# EAGLE design power-manager (EAGLE 6.4)
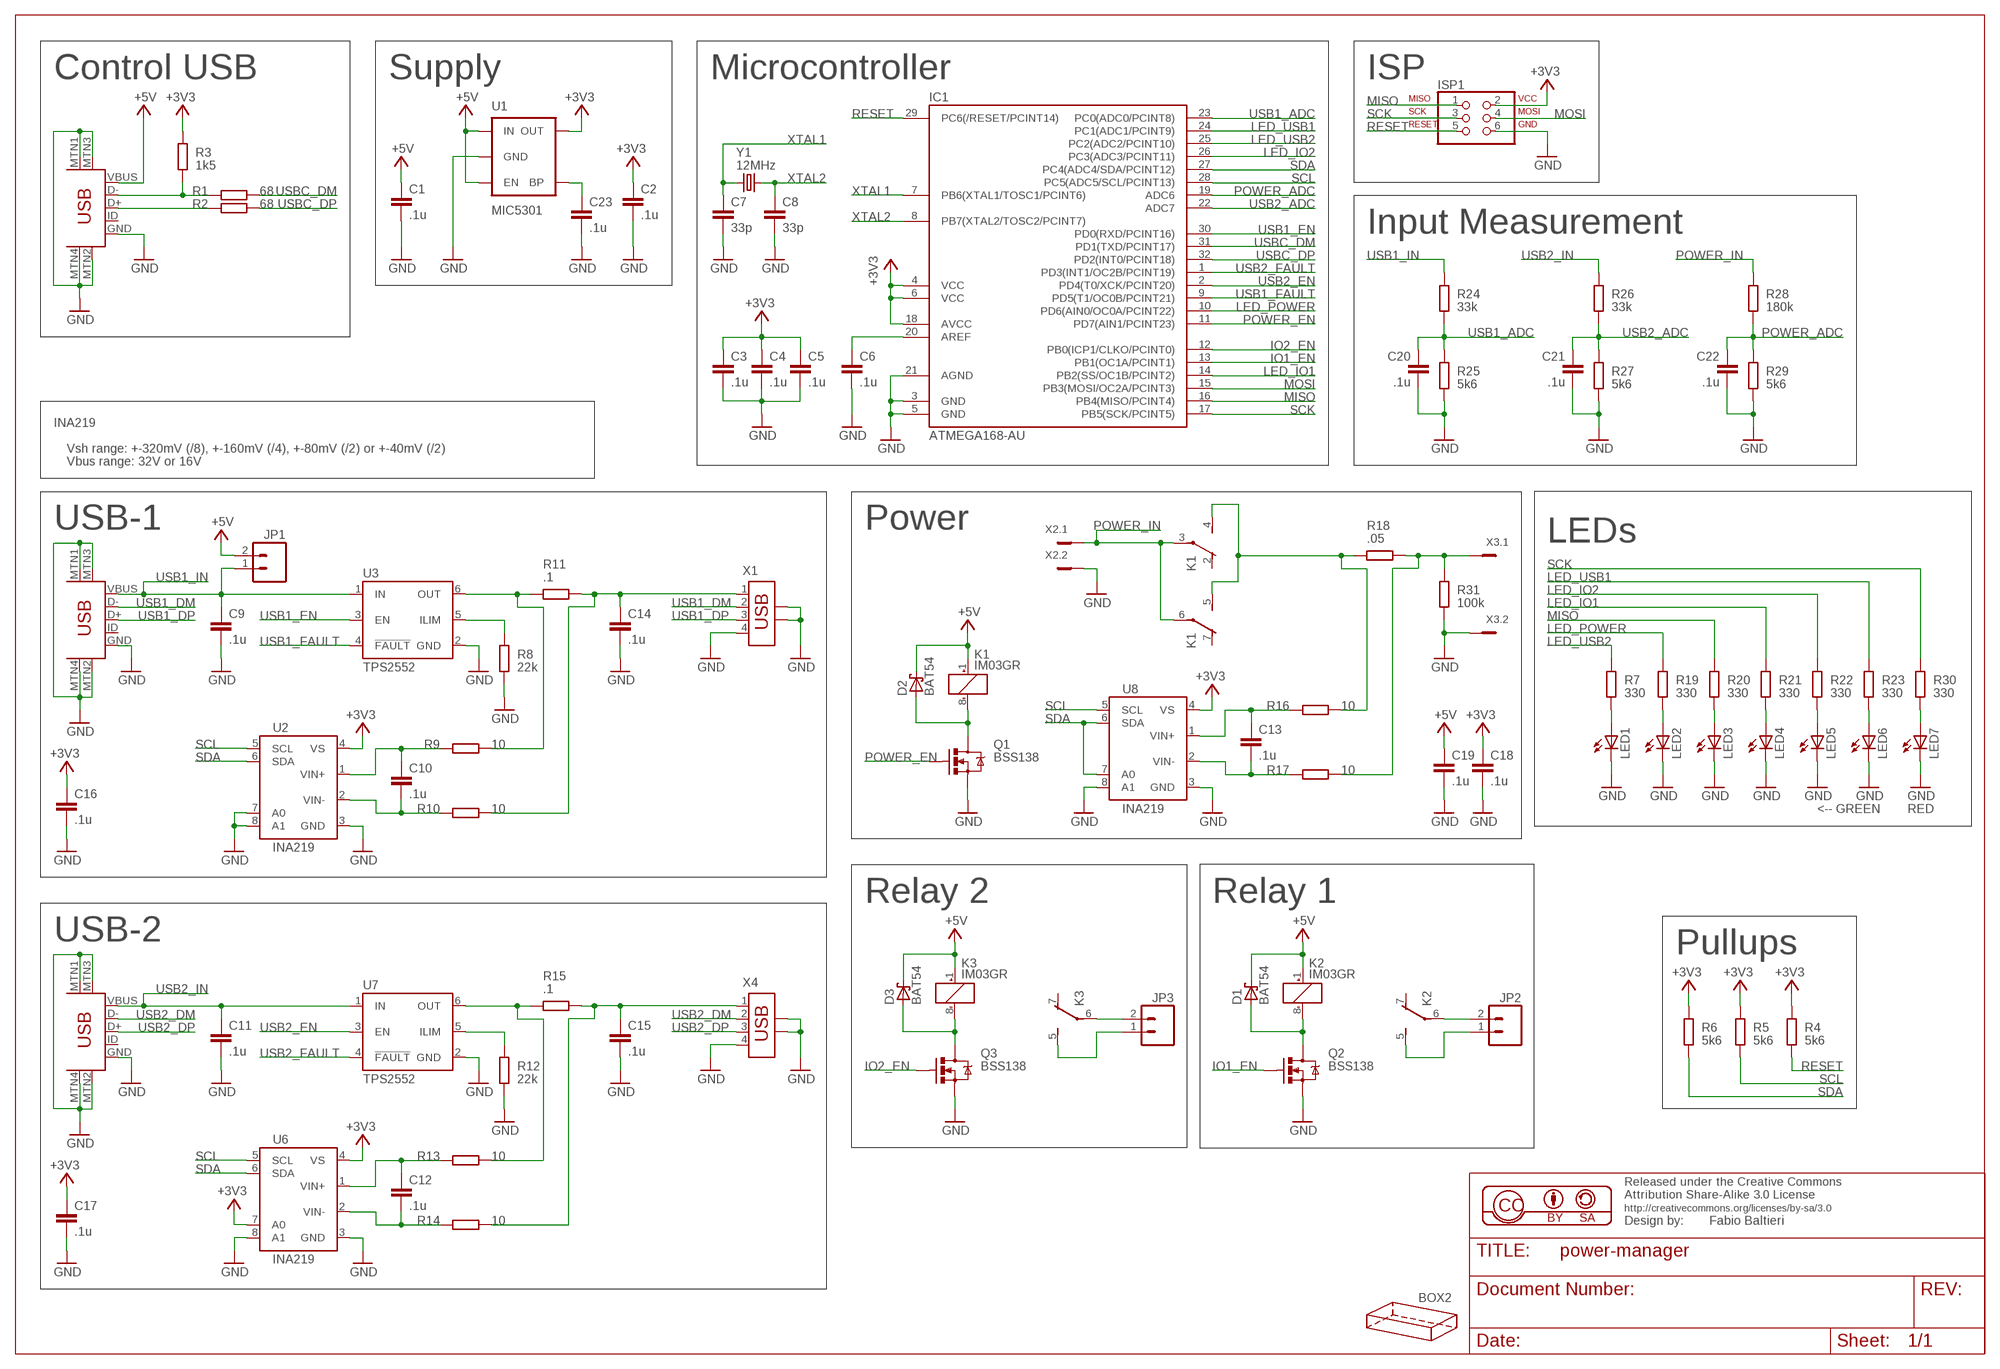
[diagram p0: schematic, sheet 1]

## Parts
BOX2  HAMMOND-BOX-K  [1551K]
C1  .1u  C-EUC0805  [C0805]
C2  .1u  C-EUC0805  [C0805]
C3  .1u  C-EUC0805  [C0805]
C4  .1u  C-EUC0805  [C0805]
C5  .1u  C-EUC0805  [C0805]
C6  .1u  C-EUC0805  [C0805]
C7  33p  C-EUC0805  [C0805]
C8  33p  C-EUC0805  [C0805]
C9  .1u  C-EUC0805  [C0805]
C10  .1u  C-EUC0805  [C0805]
C11  .1u  C-EUC0805  [C0805]
C12  .1u  C-EUC0805  [C0805]
C13  .1u  C-EUC0805  [C0805]
C14  .1u  C-EUC0805  [C0805]
C15  .1u  C-EUC0805  [C0805]
C16  .1u  C-EUC0805  [C0805]
C17  .1u  C-EUC0805  [C0805]
C18  .1u  C-EUC0805  [C0805]
C19  .1u  C-EUC0805  [C0805]
C20  .1u  C-EUC0805  [C0805]
C21  .1u  C-EUC0805  [C0805]
C22  .1u  C-EUC0805  [C0805]
C23  .1u  C-EUC0805  [C0805]
D1  BAT54  [SOT23]
D2  BAT54  [SOT23]
D3  BAT54  [SOT23]
IC1  ATMEGA168-AU  [TQFP32-08]
ISP1  ISP-AVR910PTH  [2X03]
JP1  M02PTH  [1X02]
JP2  M02PTH  [1X02]
JP3  M02PTH  [1X02]
K1  IM03GR  G6J-2FL-Y  [G6J-2FL-Y]
K2  IM03GR  G6J-2FL-Y  [G6J-2FL-Y]
K3  IM03GR  G6J-2FL-Y  [G6J-2FL-Y]
LED1  LEDSML0805  [SML0805]
LED2  LEDSML0805  [SML0805]
LED3  LEDSML0805  [SML0805]
LED4  LEDSML0805  [SML0805]
LED5  LEDSML0805  [SML0805]
LED6  LEDSML0805  [SML0805]
LED7  LEDSML0805  [SML0805]
Q1  BSS138  BSS138TRANS-00830  [SOT23-3]
Q2  BSS138  BSS138TRANS-00830  [SOT23-3]
Q3  BSS138  BSS138TRANS-00830  [SOT23-3]
R1  68  R-EU_R0603  [R0603]
R2  68  R-EU_R0603  [R0603]
R3  1k5  R-EU_R0603  [R0603]
R4  5k6  R-EU_R0603  [R0603]
R5  5k6  R-EU_R0603  [R0603]
R6  5k6  R-EU_R0603  [R0603]
R7  330  R-EU_R0603  [R0603]
R8  22k  R-EU_R0603  [R0603]
R9  10  R-EU_R0603  [R0603]
R10  10  R-EU_R0603  [R0603]
R11  .1  R-EU_R0805  [R0805]
R12  22k  R-EU_R0603  [R0603]
R13  10  R-EU_R0603  [R0603]
R14  10  R-EU_R0603  [R0603]
R15  .1  R-EU_R0805  [R0805]
R16  10  R-EU_R0603  [R0603]
R17  10  R-EU_R0603  [R0603]
R18  .05  R-EU_R0805  [R0805]
R19  330  R-EU_R0603  [R0603]
R20  330  R-EU_R0603  [R0603]
R21  330  R-EU_R0603  [R0603]
R22  330  R-EU_R0603  [R0603]
R23  330  R-EU_R0603  [R0603]
R24  33k  R-EU_R0603  [R0603]
R25  5k6  R-EU_R0603  [R0603]
R26  33k  R-EU_R0603  [R0603]
R27  5k6  R-EU_R0603  [R0603]
R28  180k  R-EU_R0603  [R0603]
R29  5k6  R-EU_R0603  [R0603]
R30  330  R-EU_R0603  [R0603]
R31  100k  R-EU_R0603  [R0603]
U1  MIC5301  V_REG_LDOSMD  [SOT23-5]
U2  INA219  [SOT23-8L]
U3  TPS2552  [SOT23-6L]
U6  INA219  [SOT23-8L]
U7  TPS2552  [SOT23-6L]
U8  INA219  [SOT23-8L]
U$1  USB-MINIB-5PIN  [USB-MINIB]
U$2  USB-MINIB-5PIN  [USB-MINIB]
U$3  USB-MINIB-5PIN  [USB-MINIB]
X1  USB-787616  [USB]
X2  MC2  [MC2]
X3  MC2  [MC2]
X4  USB-787616  [USB]
Y1  12MHz  CRYSTAL5X3  [CRYSTAL-SMD-5X3]

## Nets
+3V3: C2.1 C3.1 C4.1 C5.1 C16.1 C17.1 C18.1 IC1.4(VCC) IC1.6(VCC) IC1.18(AVCC) ISP1.2 R3.1 R4.1 R5.1 R6.1 U1.5(OUT) U2.4(VS) U6.4(VS) U6.7(A0) U8.4(VS)
+5V: C1.1 C19.1 D1.3(C) D2.3(C) D3.3(C) JP1.2 K1.1(1:+) K2.1(1:+) K3.1(1:+) U1.1(IN) U1.3(EN) U$1.VBUS
GND: C1.2 C2.2 C3.2 C4.2 C5.2 C6.2 C7.2 C8.2 C9.2 C11.2 C14.2 C15.2 C16.2 C17.2 C18.2 C19.2 C20.2 C21.2 C22.2 C23.2 IC1.3(GND) IC1.5(GND) IC1.21(AGND) ISP1.6 LED1.C LED2.C LED3.C LED4.C LED5.C LED6.C LED7.C Q1.2(S) Q2.2(S) Q3.2(S) R8.2 R12.2 R25.2 R27.2 R29.2 R31.2 U1.2(GND) U2.3(GND) U2.7(A0) U2.8(A1) U3.2(GND) U6.3(GND) U6.8(A1) U7.2(GND) U8.3(GND) U8.8(A1) U$1.GND U$1.MTN1(MTN2) U$1.MTN2(MTN3) U$1.MTN3(MTN1) U$1.MTN4 U$2.GND U$2.MTN1(MTN2) U$2.MTN2(MTN3) U$2.MTN3(MTN1) U$2.MTN4 U$3.GND U$3.MTN1(MTN2) U$3.MTN2(MTN3) U$3.MTN3(MTN1) U$3.MTN4 X1.4 X1.SHLD1 X1.SHLD2 X2.2 X3.2 X4.4 X4.SHLD1 X4.SHLD2
IO1_EN: IC1.13(PB1(OC1A/PCINT1)) Q2.1(G)
IO2_EN: IC1.12(PB0(ICP1/CLKO/PCINT0)) Q3.1(G)
LED_IO1: IC1.14(PB2(SS/OC1B/PCINT2)) R21.1
LED_IO2: IC1.26(PC3(ADC3/PCINT11)) R22.1
LED_POWER: IC1.10(PD6(AIN0/OC0A/PCINT22)) R19.1
LED_USB1: IC1.24(PC1(ADC1/PCINT9)) R23.1
LED_USB2: IC1.25(PC2(ADC2/PCINT10)) R7.1
MISO: IC1.16(PB4(MISO/PCINT4)) ISP1.1 R20.1
MOSI: IC1.15(PB3(MOSI/OC2A/PCINT3)) ISP1.4
N$1: R1.1 R3.2 U$1.D-
N$2: C6.1 IC1.20(AREF)
N$3: R2.1 U$1.D+
N$4: R8.1 U3.5(ILIM)
N$5: C23.1 U1.4(BP)
N$6: C10.2 R10.1 U2.2(VIN-)
N$7: C10.1 R9.1 U2.1(VIN+)
N$8: R9.2 R11.1 U3.6(OUT)
N$9: C14.1 R10.2 R11.2 X1.1
N$10: LED7.A R30.2
N$11: R12.1 U7.5(ILIM)
N$12: C12.2 R14.1 U6.2(VIN-)
N$13: C12.1 R13.1 U6.1(VIN+)
N$14: R13.2 R15.1 U7.6(OUT)
N$15: C15.1 R14.2 R15.2 X4.1
N$16: C13.2 R17.1 U8.2(VIN-)
N$17: C13.1 R16.1 U8.1(VIN+)
N$18: K1.4(2:S) K1.5(3:S) R16.2 R18.1
N$19: R17.2 R18.2 R31.1 X3.1
N$20: D2.1(A) K1.8(1:-) Q1.3(D)
N$22: D1.1(A) K2.8(1:-) Q2.3(D)
N$23: JP2.2 K2.6(3:P)
N$24: JP2.1 K2.5(3:S)
N$25: D3.1(A) K3.8(1:-) Q3.3(D)
N$26: JP3.2 K3.6(3:P)
N$27: JP3.1 K3.5(3:S)
N$28: LED1.A R7.2
N$29: LED2.A R19.2
N$30: LED3.A R20.2
N$31: LED4.A R21.2
N$32: LED5.A R22.2
N$33: LED6.A R23.2
POWER_ADC: C22.1 IC1.19(ADC6) R28.2 R29.1
POWER_EN: IC1.11(PD7(AIN1/PCINT23)) Q1.1(G)
POWER_IN: K1.3(2:P) K1.6(3:P) R28.1 X2.1
RESET: IC1.29(PC6(/RESET/PCINT14)) ISP1.5 R4.2
SCK: IC1.17(PB5(SCK/PCINT5)) ISP1.3 R30.1
SCL: IC1.28(PC5(ADC5/SCL/PCINT13)) R5.2 U2.5(SCL) U6.5(SCL) U8.5(SCL)
SDA: IC1.27(PC4(ADC4/SDA/PCINT12)) R6.2 U2.6(SDA) U6.6(SDA) U8.6(SDA) U8.7(A0)
USB1_ADC: C20.1 IC1.23(PC0(ADC0/PCINT8)) R24.2 R25.1
USB1_DM: U$2.D- X1.2
USB1_DP: U$2.D+ X1.3
USB1_EN: IC1.30(PD0(RXD/PCINT16)) U3.3(EN)
USB1_FAULT: IC1.9(PD5(T1/OC0B/PCINT21)) U3.4(!FAULT)
USB1_IN: C9.1 JP1.1 R24.1 U3.1(IN) U$2.VBUS
USB2_ADC: C21.1 IC1.22(ADC7) R26.2 R27.1
USB2_DM: U$3.D- X4.2
USB2_DP: U$3.D+ X4.3
USB2_EN: IC1.2(PD4(T0/XCK/PCINT20)) U7.3(EN)
USB2_FAULT: IC1.1(PD3(INT1/OC2B/PCINT19)) U7.4(!FAULT)
USB2_IN: C11.1 R26.1 U7.1(IN) U$3.VBUS
USBC_DM: IC1.31(PD1(TXD/PCINT17)) R1.2
USBC_DP: IC1.32(PD2(INT0/PCINT18)) R2.2
XTAL1: C7.1 IC1.7(PB6(XTAL1/TOSC1/PCINT6)) Y1.1
XTAL2: C8.1 IC1.8(PB7(XTAL2/TOSC2/PCINT7)) Y1.3
Unconnected: K1.2(2:O) K1.7(3:O) K2.2(2:O) K2.3(2:P) K2.4(2:S) K2.7(3:O) K3.2(2:O) K3.3(2:P) K3.4(2:S) K3.7(3:O) U$1.ID U$2.ID U$3.ID

## Notes on the sheet
- Control USB | Supply | Microcontroller | ISP
- Input Measurement
- INA219
- Vsh range: +-320mV (/8), +-160mV (/4), +-80mV (/2) or +-40mV (/2)
- Vbus range: 32V or 16V
- USB-1 | Power
- LEDs
- <-- GREEN | RED
- Relay 2 | Relay 1
- USB-2
- Pullups

## Library data of the parts
BOX2 = hammond:HAMMOND-BOX: Hammond Project boxes Hammond 1551 Transluscent Blue 50x35x20mm 1551GTBU http://www.hammondmfg.com/pdf/1551G.pdf Hammond 1551 Transluscent Blue 50x50x20mm 1551RTBU http://www.hammondmfg.com/pdf/1551R.pdf Hammond 1551 Transluscent Blue 60x35x20mm 1551HTBU http://www.hammondmfg.com/pdf/1551H.pdf Hammond 1551 Transluscent Blue 80x40x20mm 1551KTBU http://www.hammondmfg.com/pdf/1551K.pdf Hammond 1591 Transluscent Blue 100x51x22m m 1591XXATBU http://www.hammondmfg.com/pdf/1591XXA.pdf
C1-C23 = rcl:C-EU: CAPACITOR, European symbol
D1-D3 = diode:BAT54: Schottky Diodes Source: Fairchild .. BAT54.pdf
IC1 = balto:ATMEGA168
ISP1 = balto:ISP-AVR910: PIN HEADER
JP1-JP3 = SparkFun-Connectors:M02: Header 2 Standard 2-pin 0.1" header. Use with straight break away headers (SKU : PRT-00116), right angle break away headers (PRT-00553), swiss pins (PRT-00743), machine pins (PRT-00117), and female headers (PRT-00115). Molex polarized connector foot print use with SKU : PRT-08233 with associated crimp pins and housings.
K1-K3 = relay:G6J*-2?-Y: Surface-Mounting Signal Relay - G6J-Y 5.7 x 10.6 x 9 mm Source: http://www.omroncomponents.eu/ .. K125-E2-02-X.pdf; MPN: G6J-2FL-Y-TR DC4.5; OC_FARNELL: 1798618; OC_NEWARK: 04M9907
LED1-LED7 = led:LED: LED OSRAM: - CHIPLED LG R971, LG N971, LY N971, LG Q971, LY Q971, LO R971, LY R971 LH N974, LH R974 LS Q976, LO Q976, LY Q976 LO Q996 - Hyper CHIPLED LW Q18S LB Q993, LB Q99A, LB R99A - SideLED LS A670, LO A670, LY A670, LG A670, LP A670 LB A673, LV A673, LT A673, LW A673 LH A674 LY A675 LS A676, LA A676, LO A676, LY A676, LW A676 LS A679, LY A679, LG A679 - Hyper Micro SIDELED® LS Y876, LA Y876, LO Y876, LY Y876 LT Y87S - SmartLED LW L88C, LW L88S LB L89C, LB L89S, LG L890 LS L89K, LO L89K, LY L89K LS L896, LA L896, LO L896, LY L896 - TOPLED LS T670, LO T670, LY T670, LG T670, LP T670 LSG T670, LSP T670, LSY T670, LOP T670, LYG T670 LG T671, LOG T671, LSG T671 LB T673, LV T673, LT T673, LW T673 LH T674 LS T676, LA T676, LO T676, LY T676, LB T676, LH T676, LSB T676, LW T676 LB T67C, LV T67C, LT T67C, LS T67K, LO T67K, LY T67K, LW E67C LS E67B, LA E67B, LO E67B, LY E67B, LB E67C, LV E67C, LT E67C LW T67C LS T679, LY T679, LG T679 LS T770, LO T770, LY T770, LG T770, LP T770 LB T773, LV T773, LT T773, LW T773 LH T774 LS E675, LA E675, LY E675, LS T675 LS T776, LA T776, LO T776, LY T776, LB T776 LHGB T686 LT T68C, LB T68C - Hyper Mini TOPLED® LB M676 - Mini TOPLED Santana® LG M470 LS M47K, LO M47K, LY M47K Source: http://www.osram.convergy.de LUXEON: - LUMILED® LXK2-PW12-R00, LXK2-PW12-S00, LXK2-PW14-U00, LXK2-PW14-V00 LXK2-PM12-R00, LXK2-PM12-S00, LXK2-PM14-U00 LXK2-PE12-Q00, LXK2-PE12-R00, LXK2-PE12-S00, LXK2-PE14-T00, LXK2-PE14-U00 LXK2-PB12-K00, LXK2-PB12-L00, LXK2-PB12-M00, LXK2-PB14-N00, LXK2-PB14-P00, LXK2-PB14-Q00 LXK2-PR12-L00, LXK2-PR12-M00, LXK2-PR14-Q00, LXK2-PR14-R00 LXK2-PD12-Q00, LXK2-PD12-R00, LXK2-PD12-S00 LXK2-PH12-R00, LXK2-PH12-S00 LXK2-PL12-P00, LXK2-PL12-Q00, LXK2-PL12-R00 Source: www.luxeon.com KINGBRIGHT: KA-3528ASYC Source: www.kingbright.com
Q1-Q3 = SparkFun-DiscreteSemi:BSS138: NMOSFET, Enh Mode 50V/6-ohm 200mA (SOT-23) TRANS-00830; PROD_ID: TRANS-00830
R1-R31 = rcl:R-EU_: RESISTOR, European symbol
U1 = SparkFun-PowerIC:V_REG_LDO: Voltage Regulator LDO Standard 150mA LDO voltage regulator in SOT-23 layout. Micrel part MIC5205. BP (by-pass) pin is used to lower output noise with 470pF cap.
U2 U6 U8 = balto:INA219: INA219 Zero-Drift, Bi-Directional CURRENT/POWER MONITOR with I2CTM Interface
U3 U7 = balto:TPS2552: Precision adjustable current limited power distribution switch
U$1-U$3 = SparkFun-Connectors:USB-MINIB: Mini-USB "B" connector with 5th pin broken out. Created new symbol breaking out 5th "ID" pin in mini/micro USB connector spec. See: http://en.wikipedia.org/wiki/Mini_usb#Cables. Uses same footprint as 4-pin symbol. Also added pins to connect to mounting / shield pads if required (probably not generally needed as signals aren't shielded once they leave the connector).
X1 X4 = balto:USB-787616: AMP connector
X2 X3 = con-phoenix-381_l:MC2: Mini-Combicon 3.81mm horizontal 2-polig MC 1,5/2-G-3,81 Artikel-Nr. 1803277
Y1 = SparkFun-FreqCtrl:CRYSTAL: Various standard crystals. Proven footprints. Spark Fun Electronics SKU : COM-00534

## Board
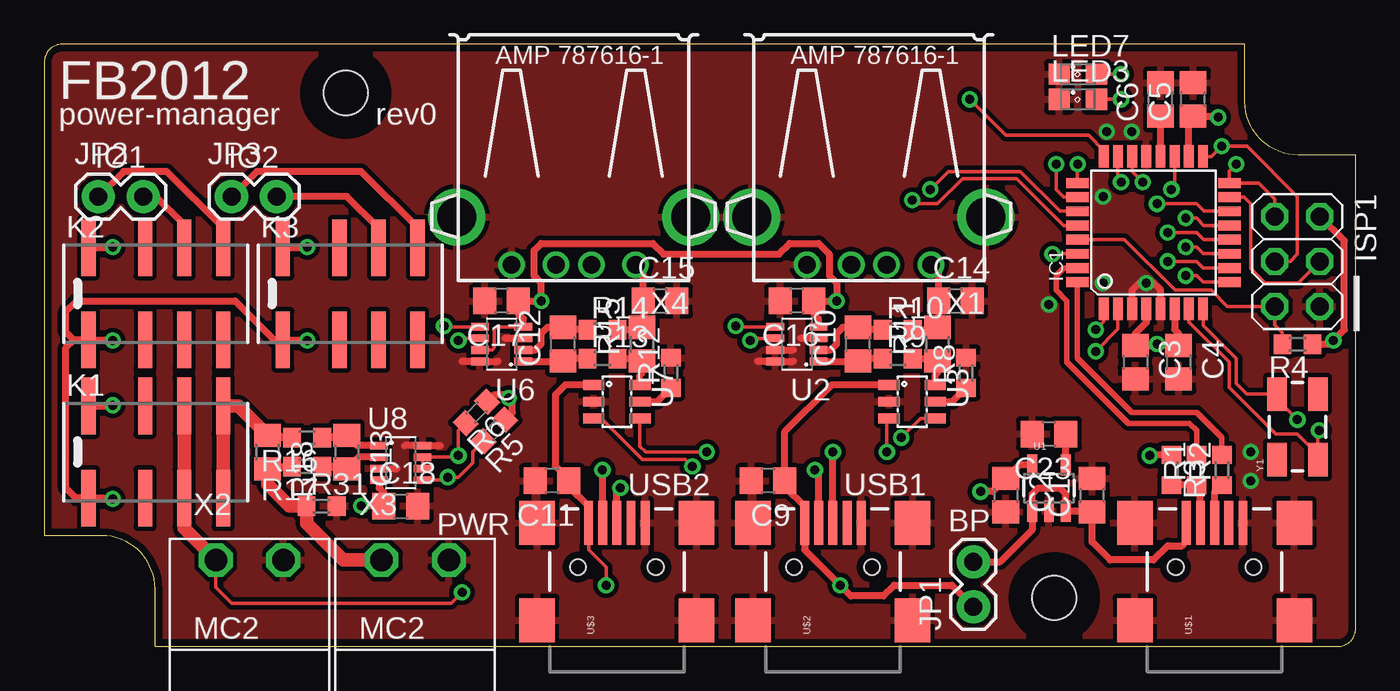
[diagram p1: board, top side]
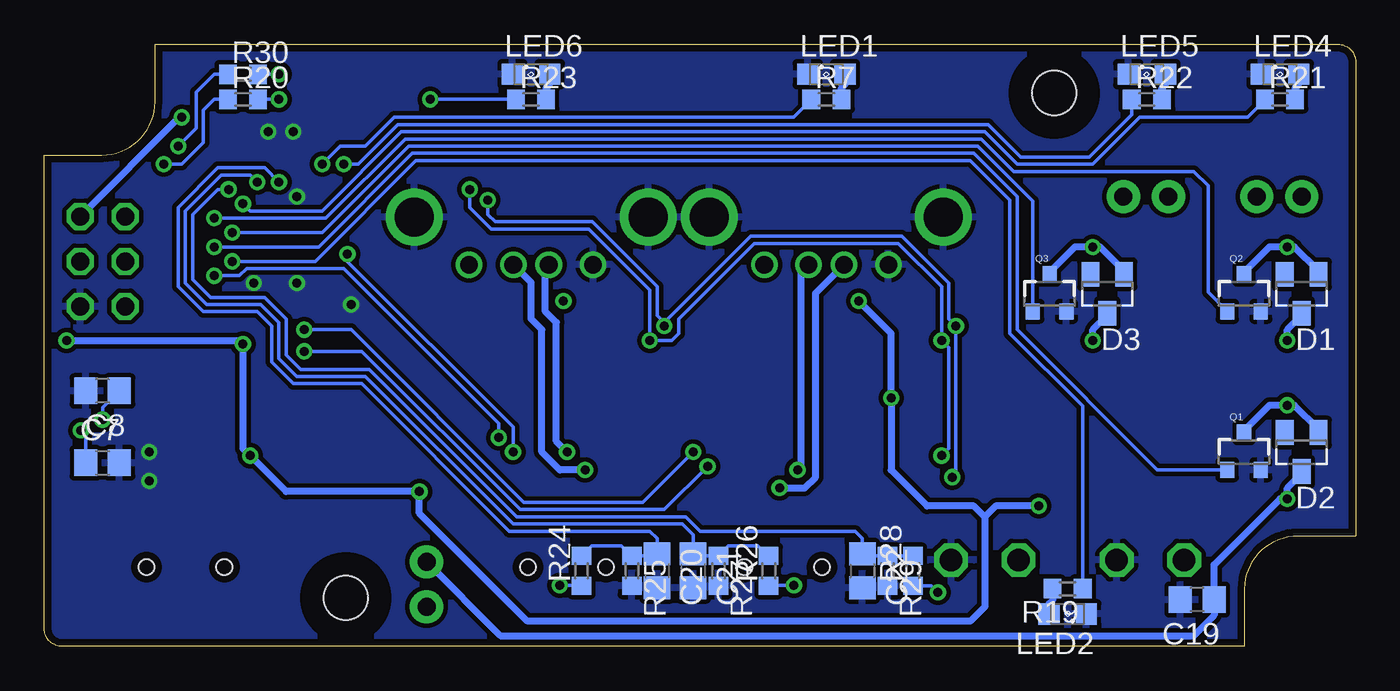
[diagram p2: board, bottom side, seen from below]

Size 74 x 34 mm. Coordinates in mm from the lower left corner, seen from the top.
Copper layers (1*16): Top 0.035mm / dielectric 1.5mm / Bottom 0.035mm
Design rules "cm *": minimum track width 8mil, minimum drill 20mil, track to track 8mil, track to pad 8mil, pad to pad 8mil, via to via 8mil, smd to smd 8mil, copper to edge 16mil, drill to drill 8mil, minimum pad ring 8mil, minimum via ring 8mil, stop-mask expansion 4mil, vias tented up to drill 20mil, thermal gap 10mil

### Footprints (pad centres in the part's own frame; a part is rotated, then mirrored left to right if it is on the bottom)
1551K = hole 2.5: 57,2.75; 17,31.25
C0805 = smd 1.3 x 1.5: 1 -0.95,0; 2 0.95,0
SOT23 = smd 1 x 1.4: 1 -0.95,-1.1; 2 0.95,-1.1; 3 0,1.1
TQFP32-08 = smd 1.27 x 0.559: 1 -4.293,2.8; 2 -4.293,2; 3 -4.293,1.2; 4 -4.293,0.4; 5 -4.293,-0.4; 6 -4.293,-1.2; 7 -4.293,-2; 8 -4.293,-2.8; 17 4.293,-2.8; 18 4.293,-2; 19 4.293,-1.2; 20 4.293,-0.4; 21 4.293,0.4; 22 4.293,1.2; 23 4.293,2; 24 4.293,2.8 | smd 0.559 x 1.27: 9 -2.8,-4.293; 10 -2,-4.293; 11 -1.2,-4.293; 12 -0.4,-4.293; 13 0.4,-4.293; 14 1.2,-4.293; 15 2,-4.293; 16 2.8,-4.293; 25 2.8,4.293; 26 2,4.293; 27 1.2,4.293; 28 0.4,4.293; 29 -0.4,4.293; 30 -1.2,4.293; 31 -2,4.293; 32 -2.8,4.293
2X03 = drill 1.016 octagon: 1 -2.54,-1.27; 2 -2.54,1.27; 3 0,-1.27; 4 0,1.27; 5 2.54,-1.27; 6 2.54,1.27
1X02 = drill 1.016 pad 1.88: 1 0,0; 2 2.54,0
G6J-2FL-Y = smd 0.8 x 3.2: 1 -3.2,-2.6; 2 0,-2.6; 3 2.2,-2.6; 4 4.4,-2.6; 5 4.4,2.6; 6 2.2,2.6; 7 0,2.6; 8 -3.2,2.6
SML0805 = smd 1.2 x 1.2: A 1.05,0; C -1.05,0
SOT23-3 = smd 0.8 x 0.9: 1 -0.95,-1; 2 0.95,-1; 3 0,1.1
R0603 = smd 1 x 1.1: 1 -0.85,0; 2 0.85,0
R0805 = smd 1.3 x 1.5: 1 -0.95,0; 2 0.95,0
SOT23-5 = smd 0.55 x 1.2: 1 -0.95,-1.3; 2 0,-1.3; 3 0.95,-1.3; 4 0.95,1.3; 5 -0.95,1.3
SOT23-8L = smd 0.44 x 1: 1 -0.975,-1.225; 2 -0.325,-1.225; 3 0.325,-1.225; 4 0.975,-1.225; 5 0.975,1.225; 6 0.325,1.225; 7 -0.325,1.225; 8 -0.975,1.225
SOT23-6L = smd 0.55 x 1.2: 1 -0.95,-1.3; 2 0,-1.3; 3 0.95,-1.3; 4 0.95,1.3; 5 0,1.3; 6 -0.95,1.3
USB-MINIB = smd 2.5 x 0.5: D+ 2.5,0; D- 2.5,0.8; GND 2.5,-1.6; ID 2.5,-0.8; VBUS 2.5,1.6 | smd 2.5 x 2: MTN1 -3,4.5; MTN2 2.5,4.5; MTN3 -3,-4.5; MTN4 2.5,-4.5 | hole 0.9: 0,2.2; 0,-2.2
USB = drill 1: 1 -3.5,12.99; 2 -1,12.99; 3 1,12.99; 4 3.5,12.99 | drill 2.2: SHLD1 -6.6,10.3; SHLD2 6.6,10.3
MC2 = drill 1.27 octagon: 1 -1.905,0; 2 1.905,0
CRYSTAL-SMD-5X3 = smd 1.9 x 1.1: 1 -1.85,-1.15; 2 1.85,-1.15; 3 1.85,1.15; 4 -1.85,1.15

### Placement (x,y rotation side)
BOX2  0,0 0 top
C1  59.13,8.53 90 top
C2  54.25,8.53 270 top
C3  61.57,16.05 270 top
C4  64.01,16.05 270 top
C5  64.82,30.89 90 top
C6  62.99,30.89 90 top
C7  70.71,10.36 0 bottom
C8  70.71,14.43 180 bottom
C9  40.84,9.35 180 top
C10  45.92,17.07 90 top
C11  28.65,9.35 180 top
C12  29.26,17.07 90 top
C13  17.07,10.97 270 top
C14  51.41,19.51 0 top
C15  34.75,19.51 0 top
C16  42.47,19.51 180 top
C17  25.81,19.51 180 top
C18  20.12,7.92 0 top
C19  8.94,2.64 180 bottom
C20  39.42,4.27 270 bottom
C21  37.39,4.27 270 bottom
C22  27.84,4.27 270 bottom
C23  56.69,11.99 180 top
D1  3.05,19.91 180 bottom
D2  3.05,10.97 180 bottom
D3  14.02,19.91 180 bottom
IC1  62.59,23.37 90 top
ISP1  70.71,21.74 270 top
JP1  52.43,2.24 90 top
JP2  3.05,25.4 0 top
JP3  10.57,25.4 0 top
K1  5.69,10.97 0 top
K2  5.69,19.91 0 top
K3  16.66,19.91 0 top
LED1  29.87,32.31 0 bottom
LED2  16.26,1.83 180 bottom
LED3  58.32,30.89 0 top
LED4  4.27,32.31 0 bottom
LED5  11.79,32.31 0 bottom
LED6  46.53,32.31 0 bottom
LED7  58.32,32.31 0 top
Q1  6.3,10.97 0 bottom
Q2  6.3,19.91 0 bottom
Q3  17.27,19.91 0 bottom
R1  65.02,9.96 90 top
R2  66.45,9.96 90 top
R3  63.6,9.96 270 top
R4  70.71,17.07 180 top
R5  25.4,12.19 225 top
R6  24.38,13.21 225 top
R7  29.87,30.89 0 bottom
R8  52.02,15.44 90 top
R9  48.16,16.26 0 top
R10  48.16,17.88 0 top
R11  50.39,17.07 90 top
R12  35.36,15.44 90 top
R13  31.5,16.26 0 top
R14  31.5,17.88 0 top
R15  33.73,17.07 90 top
R16  14.83,11.79 180 top
R17  14.83,10.16 180 top
R18  12.6,10.97 270 top
R19  16.26,3.25 180 bottom
R20  62.79,30.89 0 bottom
R21  4.27,30.89 0 bottom
R22  11.79,30.89 0 bottom
R23  46.53,30.89 0 bottom
R24  43.69,4.27 90 bottom
R25  40.84,4.27 270 bottom
R26  33.12,4.27 90 bottom
R27  35.97,4.27 270 bottom
R28  24.99,4.27 90 bottom
R29  26.42,4.27 270 bottom
R30  62.79,32.31 0 bottom
R31  15.65,7.92 0 top
U1  56.69,8.94 0 top
U2  42.47,17.07 90 top
U3  48.97,13.82 270 top
U6  25.81,17.07 90 top
U7  32.31,13.82 270 top
U8  20.12,10.36 270 top
U$1  66.04,4.47 90 top
U$2  44.5,4.47 90 top
U$3  32.31,4.47 90 top
X1  46.53,34.54 180 top
X2  11.58,4.88 0 top
X3  20.93,4.88 0 top
X4  29.87,34.54 180 top
Y1  70.71,12.4 90 top

### Tracks (layer width: path | path; a pad name or v marks a point on that pad's centre or on a via)
+3V3  (via drill 0.51)
  Top 0.203: U6.7 25.28,16.74 25.4,16.87 25.4,17.88 25.56,18.04 U6.4
  Top 0.406: IC1.18 64.59,29.7 C5.1 66.18,29.94 v66.24,29.87 | R4.1 72.54,17.07 v72.75,17.27 73.36,17.88 73.36,22.91 ISP1.2 | U2.4 43.69,18.48 43.42,18.76 C16.1 v44.7,19.51 44.7,20.52 44.3,20.93 44.3,22.15 43.69,22.76 42.06,22.76 41.45,22.15 34.95,22.15 34.34,22.76 28.04,22.76 27.64,22.35 27.64,20.93 28.04,20.52 v28.04,19.51 C17.1 26.76,18.76 27.03,18.48 U6.4 | v17.88,7.92 C18.1 19.17,8.67 18.89,8.95 U8.4 | IC1.4 62.19,18.29 61.57,17.68 C3.1 62.72,17 v62.79,17.07 62.85,17 C4.1 64.01,17.68 63.79,17.9 IC1.6 | R3.1 62.42,10.81 v62.38,10.77 | R6.1 25.4,14.22 26.01,14.22 v26.21,14.02 26.42,13.82 26.42,13.21 R5.1 | v52.83,8.74 53.51,8.74 C2.1 55.01,10.24 U1.5
  Bottom 0.406: v66.24,29.87 66.4,29.87 ISP1.2 | v72.75,17.27 62.99,17.27 v62.79,17.07 62.79,11.18 v62.38,10.77 | v17.88,7.92 20.32,7.92 20.93,7.32 | 20.93,7.32 21.54,7.92 24.18,7.92 26.21,9.96 v26.21,14.02 26.21,17.68 v28.04,19.51 | 20.93,7.32 20.93,2.23 21.74,1.42 46.74,1.42 52.83,7.52 v52.83,8.74 60.35,8.74 v62.38,10.77 | 62.18,10.57 v62.38,10.77
+5V  (via drill 0.51)
  Top 0.406: v3.86,17.27 3.82,17.31 K2.1 1.67,17.31 | v14.83,17.27 14.79,17.31 K3.1 12.96,17.31 10.77,19.51 1.83,19.51 1.22,18.9 1.22,17.76 1.67,17.31 | v3.86,8.33 3.82,8.37 K1.1 1.79,8.37 1.22,8.94 1.22,16.87 1.67,17.31 | JP1.2 53.95,4.78 55.74,6.57 U1.1 55.74,8.6 56.08,8.94 57.3,8.94 57.64,8.6 U1.3 59.08,7.64 C1.1 59.13,5.89 60.15,4.88 62.59,4.88 63.4,5.69 64.21,5.69 64.44,5.92 U$1.VBUS
  Bottom 0.406: D1.3 3.05,18.69 3.86,17.88 v3.86,17.27 | D3.3 14.02,18.69 14.83,17.88 v14.83,17.27 | D2.3 3.05,9.75 3.86,8.94 v3.86,8.33 4.27,8.33 7.99,4.61 C19.1 7.99,1.76 9.14,0.61 48.26,0.61 JP1.2
GND  (via drill 0.51)
  Top 0.406: U6.3 26.01,17.39 | 25.6,16.09 U6.8 23.57,16.09 | U2.3 42.67,17.39 | 42.27,16.09 U2.8 40.23,16.09 | U2.7 42.27,16.74 | U8.3 19.91,10.04 | 20.32,11.34 U8.8 22.35,11.34 | IC1.5 62.99,20.12 62.59,20.52 v62.18,20.52 61.79,20.52 61.39,20.12 IC1.3
  other vias: 68.07,10.97 68.07,9.35 59.74,20.52 56.69,19.3 59.74,25.4 61.37,29.06 59.94,29.06
  pour Top (isolate 0.254): -0.41,-0.41 74.37,-0.41 74.37,10.57 74.37,34.34 3.66,34.34 -0.41,34.34 -0.41,29.87
  pour Bottom (isolate 0.254): -1.02,-1.02 74.98,-1.02 74.98,34.95 -1.02,34.95
IO1_EN  (via drill 0.51)
  Top 0.203: IC1.13 65.44,23.77 65.02,24.18 v64.41,24.18
  Bottom 0.203: 7.25,19.04 Q2.1 8.33,20 8.33,26.01 9.14,26.82 19.3,26.82 21.13,28.65 53.65,28.65 58.12,24.18 v64.41,24.18
IO2_EN  (via drill 0.51)
  Top 0.203: IC1.12 65.42,22.97 65.02,23.37 v63.4,23.37
  Bottom 0.203: Q3.1 18.22,25.13 21.34,28.25 53.44,28.25 58.32,23.37 v63.4,23.37
LED_IO1  (via drill 0.51)
  Top 0.203: IC1.14 65.45,24.57 65.02,24.99 v62.79,24.99
  Bottom 0.203: R21.1 5.08,30.89 6.1,29.87 12.19,29.87 14.83,27.23 19.1,27.23 20.93,29.06 53.85,29.06 58.32,24.59 62.38,24.59 v62.79,24.99
LED_IO2  (via drill 0.51)
  Top 0.203: IC1.26 57.54,25.37 57.1,25.81 v57.1,27.23
  Bottom 0.203: 12.6,30.89 R22.1 12.64,30.04 15.04,27.64 18.9,27.64 20.73,29.46 54.05,29.46 56.29,27.23 v57.1,27.23
LED_POWER  (via drill 0.51)
  Top 0.203: IC1.10 65.4,21.37 65.02,21.74 v63.4,21.74
  Bottom 0.203: v63.4,21.74 58.73,21.74 53.03,27.43 21.74,27.43 19.51,25.2 19.51,17.68 15.41,13.58 R19.1
LED_USB1  (via drill 0.51)
  Top 0.203: IC1.24 59.79,28 58.93,28.85 54.25,28.85 v52.22,30.89
  Bottom 0.203: v52.22,30.89 R23.1
LED_USB2  (via drill 0.51)
  Top 0.203: IC1.25 58.29,27.2 v58.32,27.23
  Bottom 0.203: R7.1 30.68,30.89 31.7,29.87 54.25,29.87 55.88,28.25 57.3,28.25 v58.32,27.23
MISO  (via drill 0.51)
  Top 0.203: ISP1.1 69.44,25.25 68.52,26.17 IC1.16 66.88,26.85 v67.26,27.23
  Bottom 0.203: v67.26,27.23 66.24,27.23 65.02,28.45 65.02,30.28 64.41,30.89 R20.1
MOSI
  Top 0.203: IC1.15 67.7,25.37 68.07,24.99 68.07,21.34 68.89,20.52 70.76,20.52 ISP1.4
N$1
  Top 0.406: U$1.D- 65.24,8.89 R1.1 R3.2
N$2
  Top 0.406: IC1.20 C6.1
N$3
  Top 0.406: U$1.D+ 66.04,8.7 R2.1
N$4
  Top 0.406: U3.5 51.24,13.82 R8.1
N$5
  Top 0.406: U1.4 C23.1
N$6
  Top 0.406: R10.1 46.06,17.88 C10.2 45.04,18.02 44.7,17.68 44.7,17.07 44.38,16.74 U2.2
N$7
  Top 0.406: R9.1 46.06,16.26 C10.1 45.9,16.09 U2.1
N$8
  Top 0.406: R9.2 50.26,16.26 R11.1 50.39,15.44 50.27,15.32 U3.6
N$9
  Top 0.406: X1.1 50.46,21.13 C14.1 50.46,18.09 R11.2 50.26,17.88 R10.2
N$10  (via drill 0.51)
  Top 0.203: LED7.A v60.76,32.31
  Bottom 0.203: v60.76,32.31 R30.2
N$11
  Top 0.406: U7.5 34.58,13.82 R12.1
N$12
  Top 0.406: R14.1 29.4,17.88 C12.2 28.38,18.02 28.04,17.68 28.04,17.07 27.72,16.74 U6.2
N$13
  Top 0.406: R13.1 29.4,16.26 C12.1 29.24,16.09 U6.1
N$14
  Top 0.406: U7.6 33.61,15.32 33.73,15.44 R15.1 33.59,16.26 R13.2
N$15
  Top 0.406: X4.1 33.8,21.13 C15.1 33.8,18.09 R15.2 33.59,17.88 R14.2
N$16
  Top 0.406: R17.1 16.26,10.16 16.39,10.02 C13.2 17.73,10.69 U8.2
N$17
  Top 0.406: R16.1 16.26,11.79 16.39,11.92 C13.1 17.65,11.34 U8.1
N$18
  Top 0.406: R18.1 13.27,11.92 13.41,11.79 R16.2
  Top 0.762: K1.4 K1.5 10.95,13.57 R18.1
N$19
  Top 0.406: R18.2 13.27,10.02 13.41,10.16 R17.2
  Top 0.762: R18.2 12.6,9.14 13.82,7.92 R31.1 14.8,6.95 16.87,4.88 X3.1
N$20  (via drill 0.51)
  Top 0.406: K1.8 3.82,13.57 v3.86,13.61
  Bottom 0.406: D2.1 2.1,12.26 3.45,13.61 v3.86,13.61 4.88,13.61 6.3,12.19 Q1.3
N$22  (via drill 0.51)
  Top 0.406: K2.8 3.82,22.51 v3.86,22.55
  Bottom 0.406: D1.1 2.1,21.2 3.45,22.55 v3.86,22.55 4.88,22.55 6.3,21.13 Q2.3
N$23
  Top 0.406: K2.6 7.89,23.81 6.3,25.4 JP2.2
N$24
  Top 0.406: K2.5 10.09,23.64 6.91,26.82 4.47,26.82 JP2.1
N$25  (via drill 0.51)
  Top 0.406: K3.8 14.79,22.51 v14.83,22.55
  Bottom 0.406: D3.1 13.07,21.2 14.43,22.55 v14.83,22.55 15.85,22.55 17.27,21.13 Q3.3
N$26
  Top 0.406: K3.6 18.86,23.61 17.07,25.4 JP3.2
N$27
  Top 0.406: K3.5 21.06,23.64 17.88,26.82 11.99,26.82 JP3.1
N$28
  Bottom 0.406: R7.2 29.02,31.53 28.82,31.73 LED1.A
N$29
  Bottom 0.406: LED2.A 17.31,2.4 17.11,2.6 R19.2
N$30  (via drill 0.51)
  Top 0.203: LED3.A v60.76,30.89
  Bottom 0.203: R20.2 v60.76,30.89
N$31
  Bottom 0.406: R21.2 3.42,31.53 3.22,31.73 LED4.A
N$32
  Bottom 0.406: R22.2 10.94,31.53 10.74,31.73 LED5.A
N$33
  Bottom 0.406: R23.2 45.68,31.53 45.48,31.73 LED6.A
POWER_ADC  (via drill 0.51)
  Top 0.203: IC1.19 63.79,25.99 v63.6,25.81
  Bottom 0.203: R28.2 R29.1 27.74,5.12 C22.1 27.84,6.1 28.25,6.5 36.98,6.5 37.8,7.32 47.35,7.32 55.68,15.65 59.54,15.65 60.35,16.46 60.35,18.49 61.57,19.71 64.62,19.71 65.63,20.73 65.63,24.38 64.21,25.81 v63.6,25.81
POWER_EN  (via drill 0.51)
  Top 0.203: IC1.11 65.41,22.17 65.02,22.55 v64.41,22.55
  Bottom 0.203: Q1.1 11.19,9.97 19.1,17.88 19.1,25.4 21.54,27.84 53.24,27.84 58.52,22.55 v64.41,22.55
POWER_IN  (via drill 0.51)
  Top 0.203: X2.1 9.68,3.33 10.57,2.44 22.96,2.44 v23.57,3.05
  Top 0.762: X2.1 7.89,6.67 K1.3 K1.6
  Bottom 0.203: R28.1 23.94,3.42 v23.57,3.05
RESET
  Top 0.203: R4.2 69.86,17.72 69.44,18.14 ISP1.5 66.75,19.2 65.84,20.12 63.8,20.12 60.95,22.97 IC1.29
SCK  (via drill 0.51)
  Top 0.203: ISP1.3 70.31,21.74 70.71,22.15 70.71,25.4 67.87,28.25 v66.45,28.25 65.86,27.66 IC1.17
  Bottom 0.203: v66.45,28.25 65.43,29.26 65.43,31.29 64.41,32.31 R30.1
SCL  (via drill 0.51)
  Top 0.203: U6.5 22.6,18.04 v22.55,18.09 | U2.5 39.05,18.04 v39.01,18.09 | U8.5 22.6,9.39 v22.76,9.55 23.37,9.55 24.18,10.36 24.18,10.97 R5.2 | IC1.28 57.51,23.77 54.86,26.42 51.82,26.42 50.39,24.99 49.17,24.99 v48.97,25.2
  Bottom 0.203: 39.01,18.29 34.14,23.16 25.6,23.16 22.96,20.52 22.96,18.49 v22.55,18.09 22.55,9.75 v22.76,9.55 | v39.01,18.09 39.01,18.29 | 39.01,18.29 39.42,18.69 39.42,20.32 43.08,23.98 48.56,23.98 48.97,24.38 v48.97,25.2
SDA  (via drill 0.51)
  Top 0.203: U6.6 23.49,17.39 v23.37,17.27 | U2.6 39.95,17.39 v39.83,17.27 | IC1.27 57.32,24.57 55.07,26.82 51,26.82 v49.99,25.81 | U8.6 U8.7 23.29,10.69 v23.37,10.77 23.37,12.19 R6.2
  Bottom 0.203: v23.37,10.77 22.96,11.18 22.96,16.87 v23.37,17.27 23.37,20.32 25.81,22.76 33.93,22.76 38.2,18.49 38.2,17.68 38.61,17.27 v39.83,17.27 39.83,20.12 43.28,23.57 48.77,23.57 49.99,24.79 v49.99,25.81
USB1_ADC  (via drill 0.51)
  Top 0.203: IC1.23 60.59,26.38 v60.76,26.21
  Bottom 0.203: R24.2 43.12,5.69 41.45,5.69 40.88,5.12 R25.1 39.52,5.12 C20.1 39.42,6.1 39.83,6.5 47.75,6.5 56.08,14.83 59.94,14.83 61.16,16.05 61.16,18.09 61.98,18.9 65.02,18.9 66.45,20.32 66.45,24.79 64.21,27.03 61.57,27.03 v60.76,26.21
USB1_DM  (via drill 0.51)
  Top 0.406: U$2.D- 43.7,9.74 v43.48,9.96
  Bottom 0.406: v43.48,9.96 44.91,9.96 45.92,10.97 45.92,17.88 46.53,18.49 46.53,20.55 X1.2
USB1_DP  (via drill 0.51)
  Top 0.406: U$2.D+ v44.5,10.97
  Bottom 0.406: v44.5,10.97 45.11,11.58 45.11,18.29 45.72,18.9 45.72,21.37 X1.3
USB1_EN  (via drill 0.51)
  Top 0.203: IC1.30 56.91,22.17 v56.9,22.15 | v47.55,10.97 47.55,12.74 U3.3
  Bottom 0.203: v47.55,10.97 47.55,12.39 56.9,21.74 v56.9,22.15
USB1_FAULT  (via drill 0.51)
  Top 0.203: U3.4 49.44,12.87 v48.36,11.79 | IC1.9 65.39,20.57 65.02,20.93 v64.41,20.93
  Bottom 0.203: v48.36,11.79 48.36,12.6 57.1,21.34 62.59,21.34 62.99,20.93 v64.41,20.93
USB1_IN  (via drill 0.51)
  Top 0.406: U3.1 44.44,14.77 41.79,12.13 C9.1 41.79,9.01 42.9,7.9 U$2.VBUS 42.9,5.46 v44.91,3.45 45.52,2.85 47.35,2.85 47.95,3.45 51.21,3.45 JP1.1
  Bottom 0.203: v44.91,3.45 43.73,3.45 R24.1
USB2_ADC  (via drill 0.51)
  Top 0.203: IC1.22 61.39,26.8 v61.98,26.21
  Bottom 0.203: R26.2 33.16,5.12 33.73,5.69 35.39,5.69 R27.1 37.29,5.12 C21.1 37.39,6.3 38,6.91 47.55,6.91 55.88,15.24 59.74,15.24 60.76,16.26 60.76,18.29 61.77,19.3 64.82,19.3 66.04,20.52 66.04,24.59 64.01,26.62 62.38,26.62 v61.98,26.21
USB2_DM  (via drill 0.51)
  Top 0.406: U$3.D- 31.51,9.94 v31.5,9.96
  Bottom 0.406: v31.5,9.96 31.29,10.16 31.29,21.13 X4.2
USB2_DP  (via drill 0.51)
  Top 0.406: U$3.D+ 32.31,8.74 v32.51,8.94
  Bottom 0.406: v32.51,8.94 31.09,8.94 30.48,9.55 30.48,19.94 X4.3
USB2_EN  (via drill 0.51)
  Top 0.203: U7.3 31.43,12.87 33.73,10.57 36.17,10.57 v36.58,10.16 | IC1.2 60.59,17.91 v59.33,16.66
  Bottom 0.203: v36.58,10.16 39.01,7.72 47.14,7.72 56.08,16.66 v59.33,16.66
USB2_FAULT  (via drill 0.51)
  Top 0.203: U7.4 33.61,11.3 33.93,10.97 v37.39,10.97 | IC1.1 59.79,18.33 v59.33,17.88
  Bottom 0.203: v37.39,10.97 40.23,8.13 46.94,8.13 56.69,17.88 v59.33,17.88
USB2_IN  (via drill 0.51)
  Top 0.203: U$3.VBUS 30.71,5.46 31.7,4.47 v31.7,3.45
  Top 0.406: U$3.VBUS 30.71,7.9 29.6,9.01 C11.1 29.6,9.41 28.85,10.16 28.85,14.22 29.4,14.77 U7.1
  Bottom 0.203: v31.7,3.45 33.08,3.45 R26.1
USBC_DM
  Top 0.305: R1.2 65.02,12.19 64.62,12.6 61.16,12.6 57.71,16.05 57.71,19.51 57.1,20.12 57.1,20.93 57.54,21.37 IC1.31
USBC_DP
  Top 0.305: R2.2 66.45,11.79 65.02,13.21 61.37,13.21 58.29,16.28 IC1.32
XTAL1  (via drill 0.51)
  Top 0.203: IC1.7 64.59,18.32 66.85,16.05 66.85,14.63 69.49,11.99 70.71,11.99 71.86,10.84 Y1.1 71.86,12.12 v71.93,12.19
  Bottom 0.203: C7.1 71.66,11.92 v71.93,12.19
XTAL2  (via drill 0.51)
  Top 0.203: IC1.8 65.39,18.13 67.26,16.26 67.26,14.83 67.85,14.24 Y1.3 | 69.54,14.22 Y1.3 | Y1.3 69.56,13.95 v70.71,12.8
  Bottom 0.203: v70.71,12.8 70.71,13.48 C8.1

### Text on the board
_tsilk: FB2012 | power-manager | rev0 | IO1 | IO2 | _ | USB2 | USB1 | BP | PWR